# EAGLE schematic 8BIT_ADD_SUB (EAGLE 6.5.0), part 2 of 2
## Sheet 25 of 25
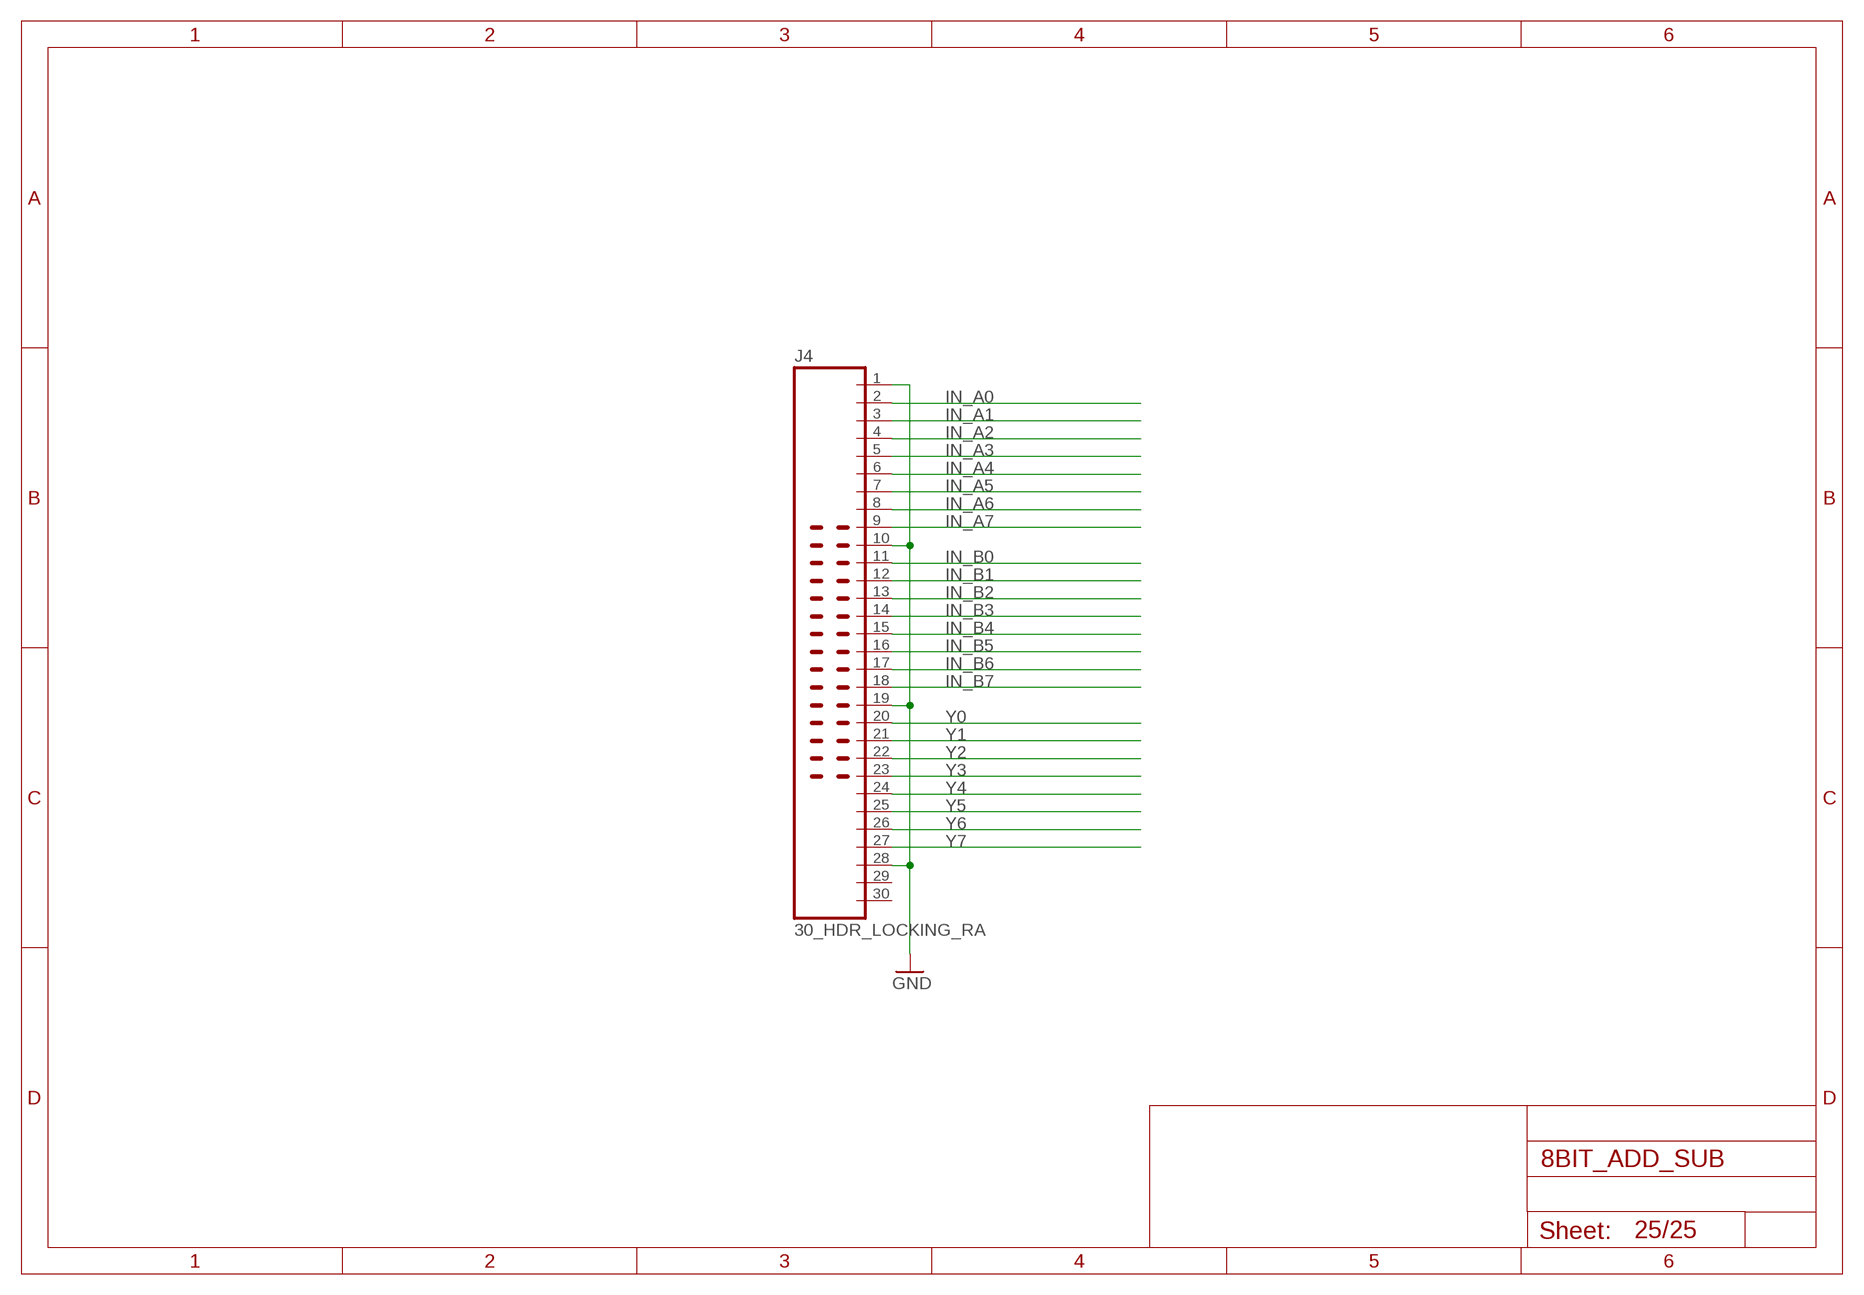
[diagram p24: schematic, sheet 25]

### Parts
J4  30_HDR_LOCKING_RA  [30_HDR_LOCKING_RA]

### Nets
GND: J4.1 J4.10 J4.19 J4.28 ; also sheet 1,2,3,4,5,6,7,8,9,10,11,12,13,14,15,16,17,18,19,20,21,22,23,24
IN_A0: J4.2 ; also sheet 2,3,8,9
IN_A1: J4.3 ; also sheet 2,3,10,11
IN_A2: J4.4 ; also sheet 2,3,12,13
IN_A3: J4.5 ; also sheet 2,3,14,15
IN_A4: J4.6 ; also sheet 2,3,16,17
IN_A5: J4.7 ; also sheet 2,3,18,19
IN_A6: J4.8 ; also sheet 2,3,20,21
IN_A7: J4.9 ; also sheet 2,3,22,23
IN_B0: J4.11 ; also sheet 2,3,4
IN_B1: J4.12 ; also sheet 2,3,4
IN_B2: J4.13 ; also sheet 2,3,5
IN_B3: J4.14 ; also sheet 2,3,5
IN_B4: J4.15 ; also sheet 2,3,6
IN_B5: J4.16 ; also sheet 2,3,6
IN_B6: J4.17 ; also sheet 2,3,7
IN_B7: J4.18 ; also sheet 2,3,7
Y0: J4.20 ; also sheet 2,8
Y1: J4.21 ; also sheet 2,10
Y2: J4.22 ; also sheet 2,12
Y3: J4.23 ; also sheet 2,14
Y4: J4.24 ; also sheet 2,16
Y5: J4.25 ; also sheet 2,18
Y6: J4.26 ; also sheet 2,20
Y7: J4.27 ; also sheet 2,22
Unconnected: J4.29 J4.30

## Library data of the parts
C1-C5 = MyLib:C_P2INCH
C6 = MyLib:POLARISED_CAP_2P5
D1-D161 D163-D172 = MyLib:L-1334SRT
HOLE1-HOLE8 = MyLib:3M_MOUNT_HOLE
J1-J3 = MyLib:20_HDR_LOCKING_RA
J4 = MyLib:30_HDR_LOCKING_RA
PP1 PP2 = MyLib:POWER_PAD
Q1-Q213 = MyLib:2N7000
R1-R275 R277-R289 = MyLib:R_P2INCH
TP1-TP7 = MyLib:TEST_LOOP